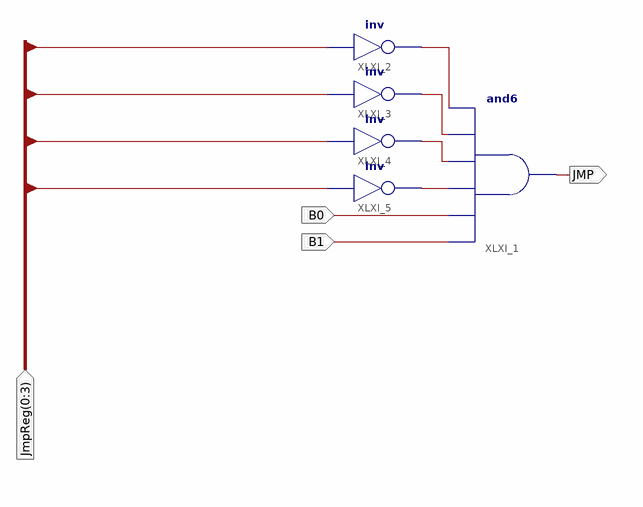
[diagram p0: schematic sheet 1]
// Xilinx ISE schematic JumpReg.sch (spartan3e) as structural Verilog: 5 symbols, 4 ports
module JumpReg (
  input  [0:3] JmpReg,
  input  B0,
  input  B1,
  output JMP
);

  wire XLXN_1, XLXN_2, XLXN_3, XLXN_5;

  and XLXI_1 (JMP, B1, B0, XLXN_3, XLXN_5, XLXN_2, XLXN_1);
  not XLXI_2 (XLXN_1, JmpReg[0]);
  not XLXI_3 (XLXN_2, JmpReg[1]);
  not XLXI_4 (XLXN_5, JmpReg[2]);
  not XLXI_5 (XLXN_3, JmpReg[3]);
endmodule
